# EAGLE board MicroRC-C (EAGLE 5.11), part 1 of 2
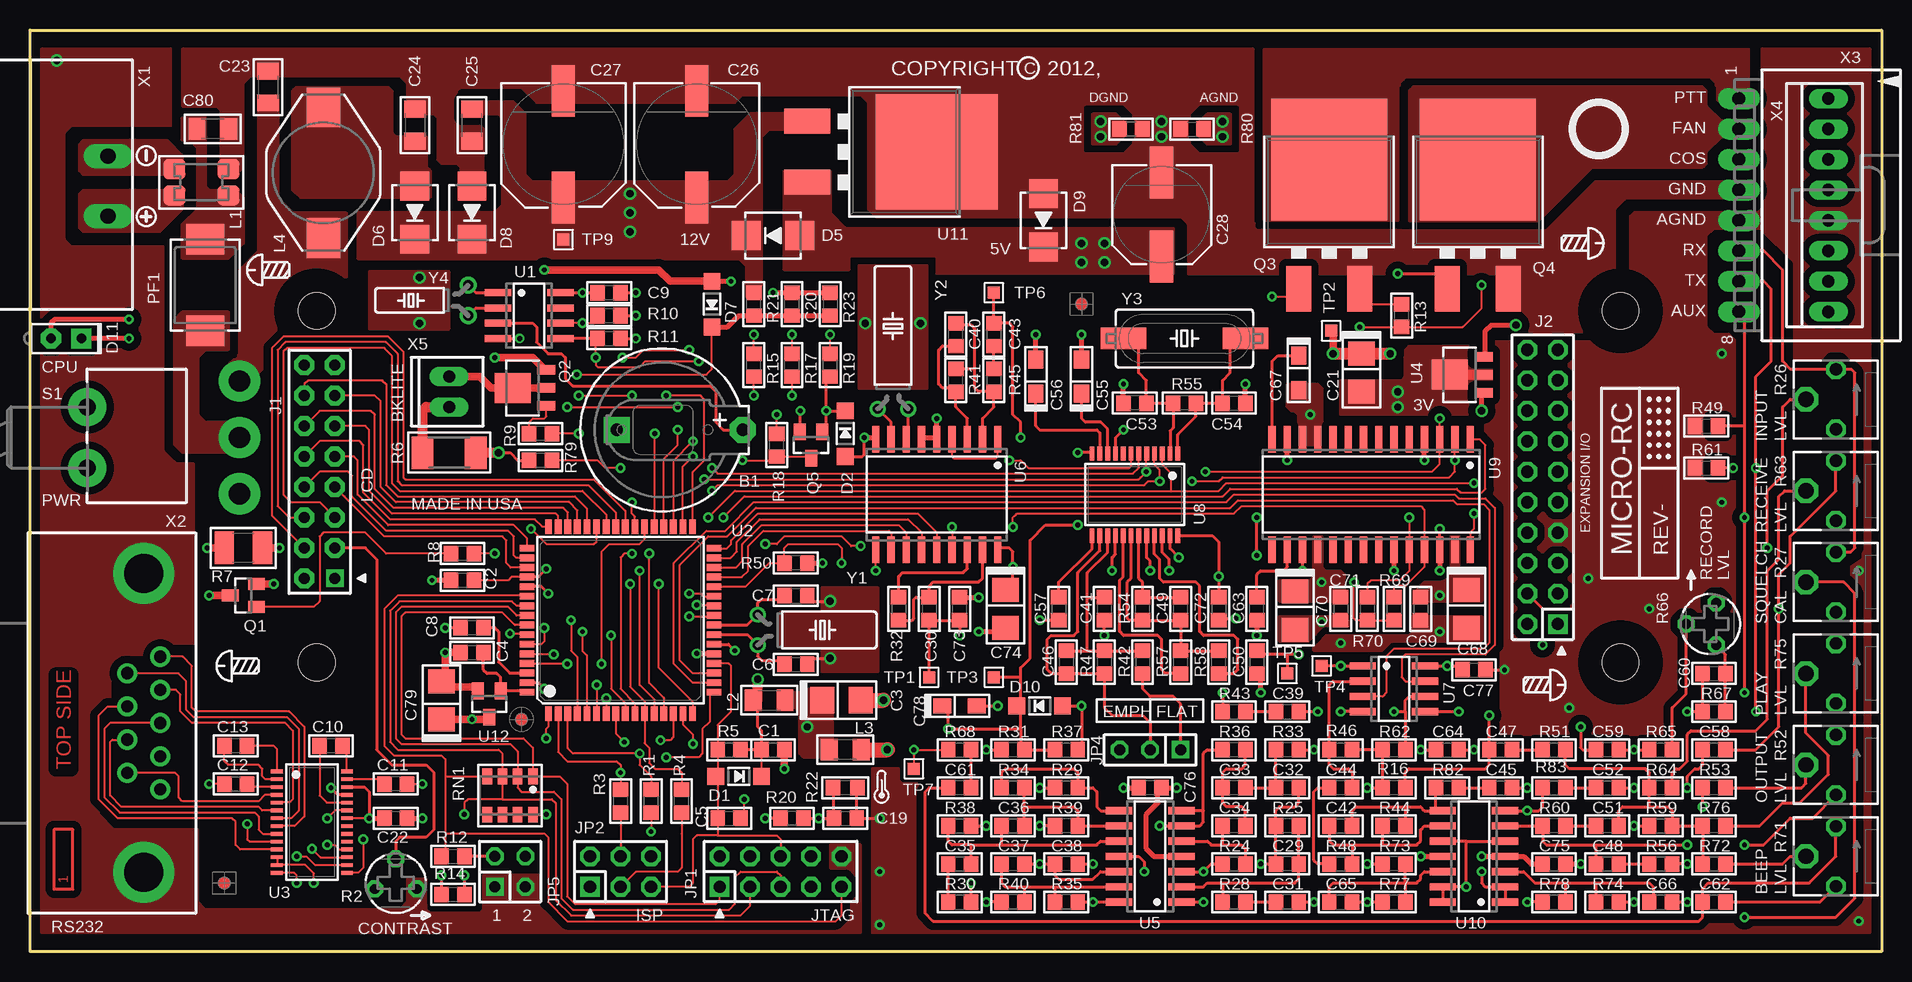
[diagram p3: board, top side]
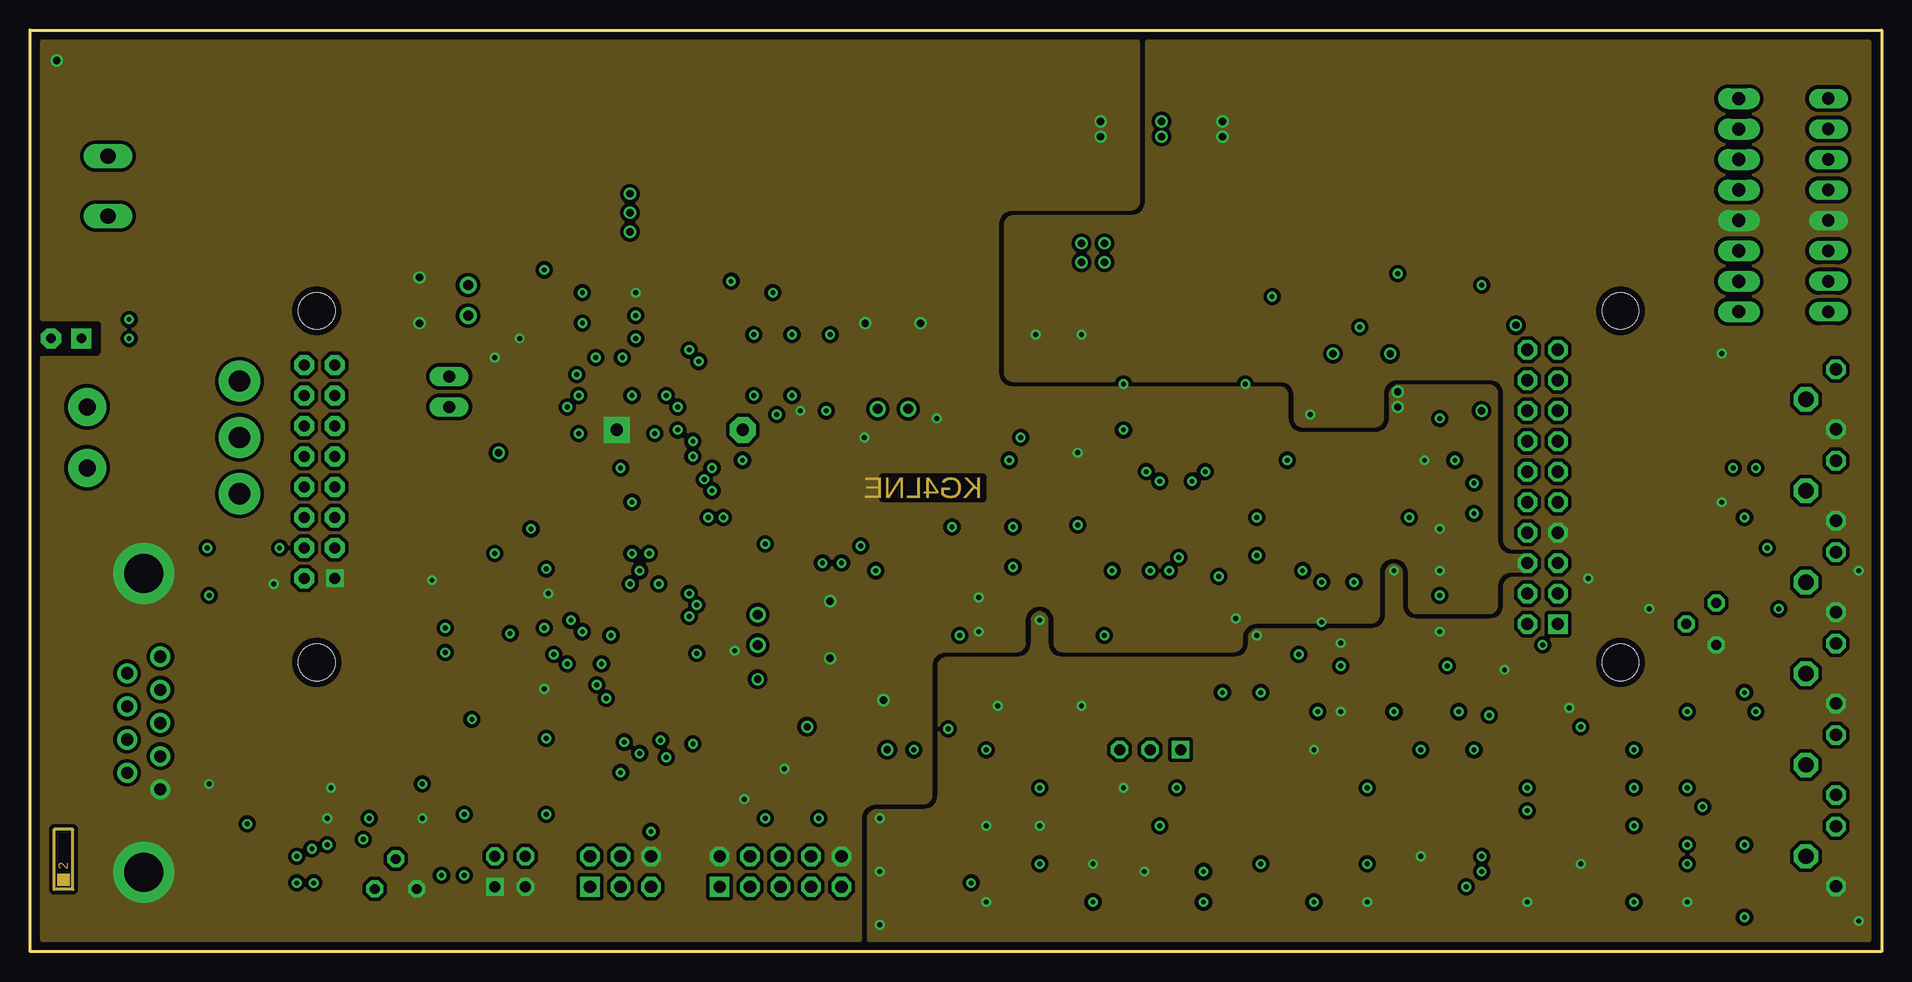
[diagram p4: board, inner layer GROUND]
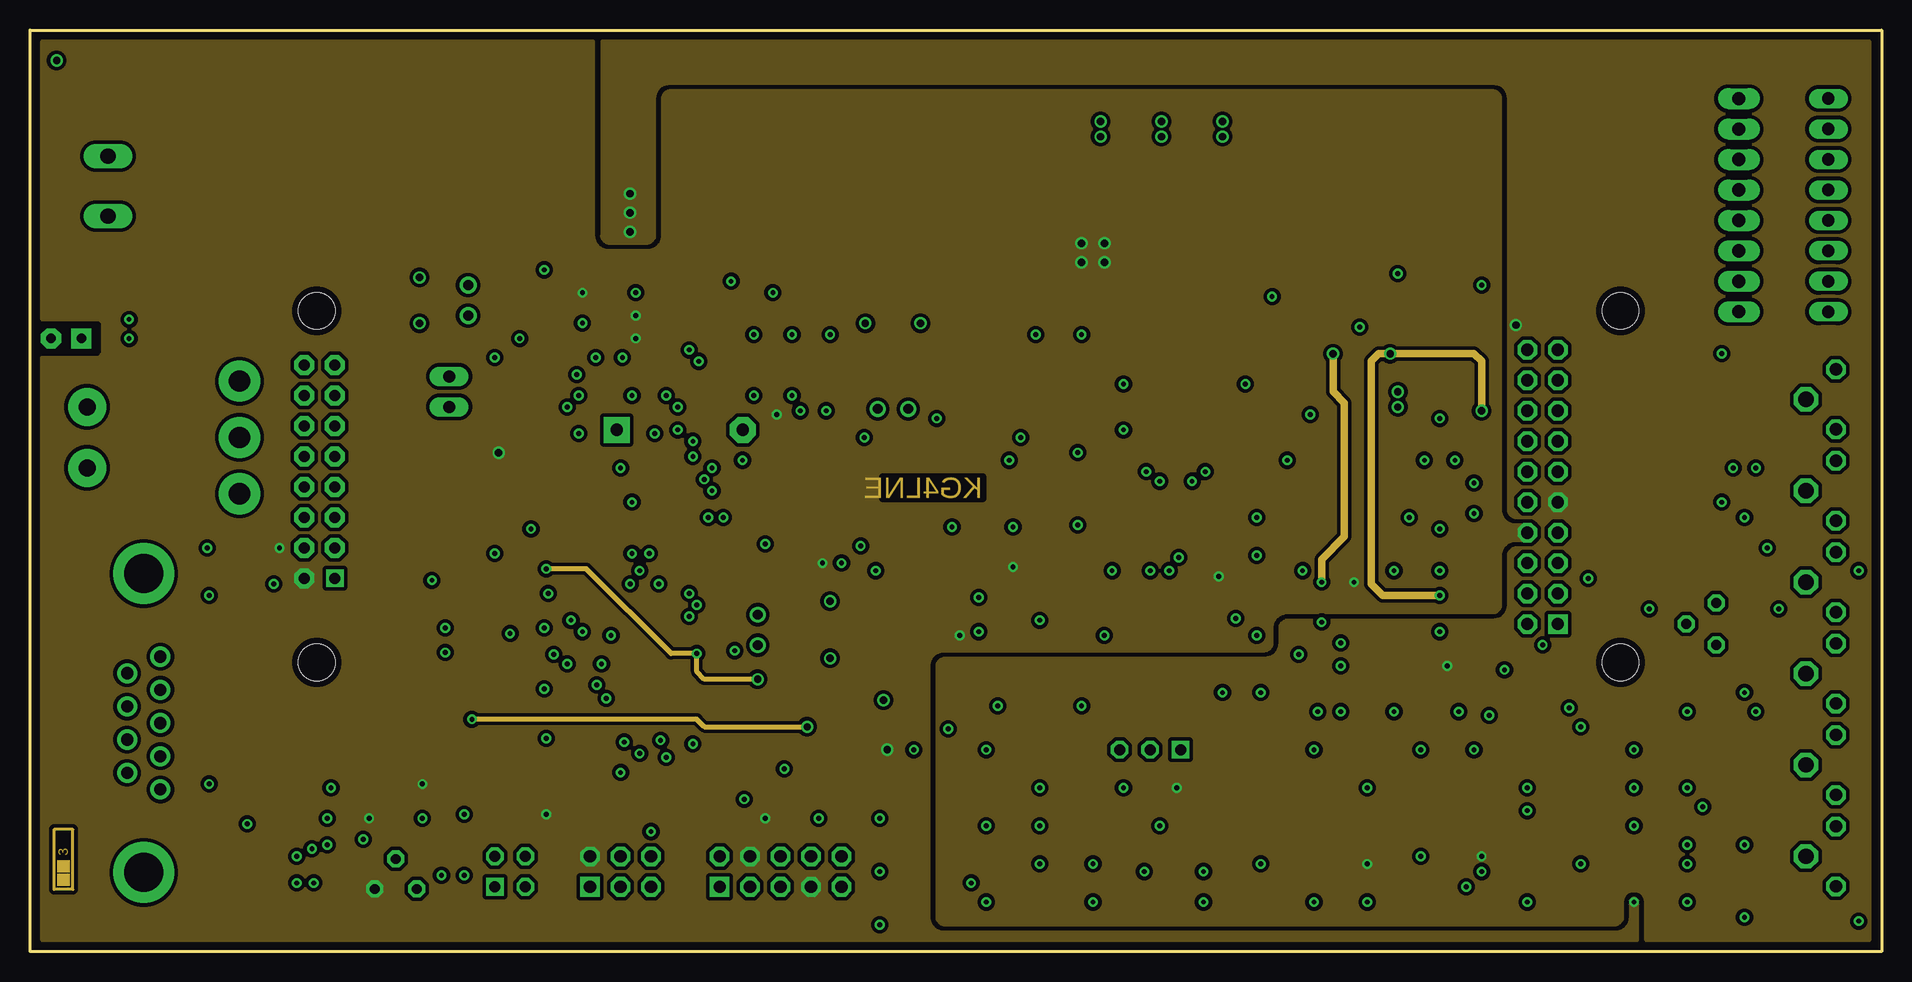
[diagram p5: board, inner layer SUPPLY]
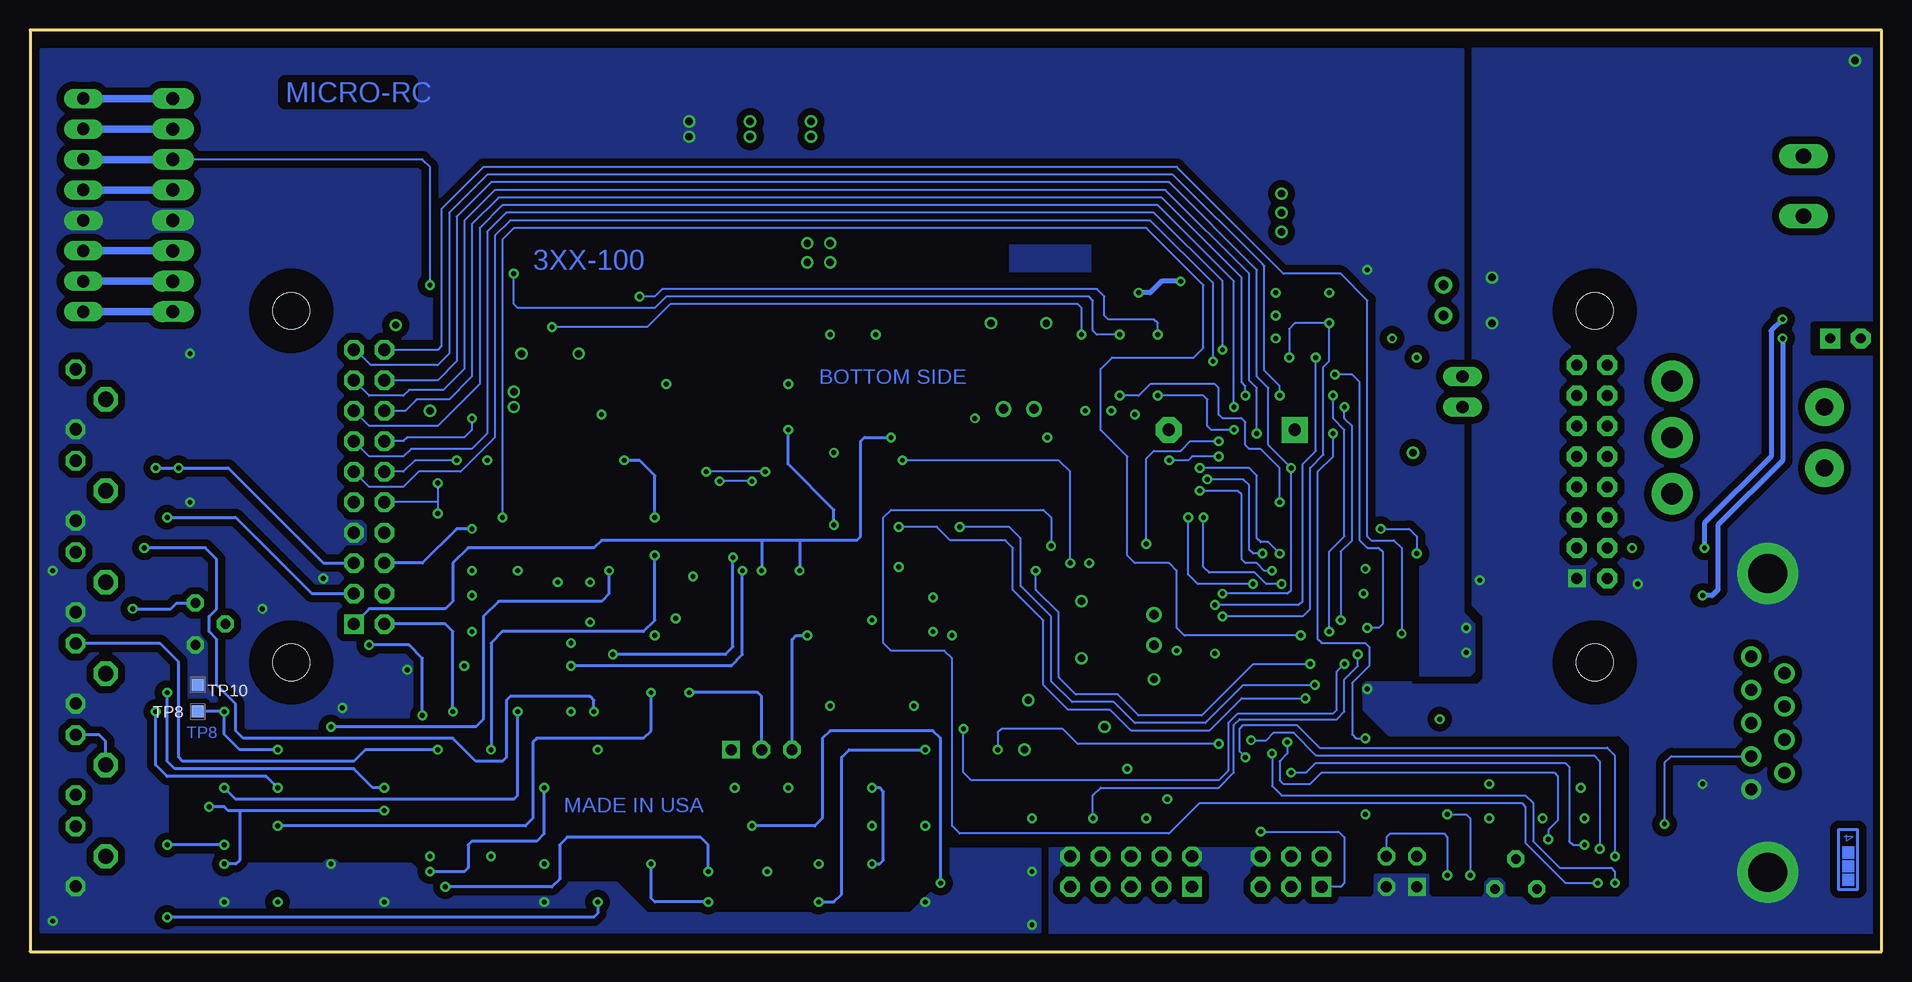
[diagram p6: board, bottom side, seen from below]

Size 154.31 x 76.83 mm. Coordinates in mm from the lower left corner, seen from the top.
Outline: 0,76.83 154.31,76.83 154.31,0 0,0 0,76.83
Copper layers (1*2+3*16): Top 0.035mm / dielectric 0.36mm / GROUND 0.035mm / dielectric 0.71mm / SUPPLY 0.035mm / dielectric 0.36mm / Bottom 0.035mm
Design rules "PRD_SN": minimum track width 2mil, minimum drill 16mil, track to track 8mil, track to pad 8mil, pad to pad 8mil, via to via 8mil, smd to smd 8mil, copper to edge 20mil, drill to drill 8mil, minimum pad ring 10mil, minimum via ring 8mil, stop-mask expansion 4mil, vias tented up to drill 32mil, thermal gap 24mil
Holes 0.41 mm at 198.11,50.4
Holes 0.61 mm at 198.11,45.32
Holes 0.81 mm at 198.11,40.24
Holes 0.91 mm at 198.11,35.16
Holes 1.02 mm at 198.11,30.08
Holes 1.09 mm at 198.11,25
Holes 1.27 mm at 198.11,19.92
Holes 1.42 mm at 198.11,14.84
Holes 1.78 mm at 198.11,9.76
Holes 3.05 mm at 198.11,4.68

## Footprints (pad centres in the part's own frame; a part is rotated, then mirrored left to right if it is on the bottom)
BR1225 = drill 1.016 pad 2.159 octagon: + 5.75,0 | drill 1.016 pad 2.159 square: - -4.75,0
C0805 = smd 1.2 x 1.3: 1 -0.953,0; 2 0.953,0
C3528/T = smd 2 x 2.2: + 1.587,0; - -1.587,0
C1206 = smd 1.4 x 1.8: 1 -1.329,0; 2 1.329,0
CSV-G = smd 4.318 x 1.93: + -4.445,0; - 4.445,0
CSV-E/F = smd 4.318 x 1.93: + -3.493,0; - 3.493,0
C3216/T = smd 1.5 x 1.27: + 1.429,0; - -1.429,0
SOD123 = smd 1.4 x 1.4: A 1.905,0; C -1.905,0
SMB = smd 2.4 x 2.4: A 2.223,0; C -2.223,0
LED535 = drill 0.813 pad 1.676 octagon: A -1.27,0 | drill 0.813 pad 1.676 square: K 1.27,0
DMC20261 = drill 0.914 pad 1.422 square: 1 2.54,-7.62 | drill 0.914 pad 1.676 octagon: 2 0,-7.62; 3 2.54,-5.08; 4 0,-5.08; 5 2.54,-2.54; 6 0,-2.54; 7 2.54,0; 8 0,0; 9 2.54,2.54; 10 0,2.54; 11 2.54,5.08; 12 0,5.08; 13 2.54,7.62; 14 0,7.62; 15 2.54,10.16; 16 0,10.16 | hole 3.048: 1.039,14.683; 1.039,-14.635; 109.674,-14.635; 109.674,14.682
MA10-2 = drill 1.016 square: 1 -11.43,-1.27 | drill 1.016 octagon: 2 -11.43,1.27; 3 -8.89,-1.27; 4 -8.89,1.27; 5 -6.35,-1.27; 6 -6.35,1.27; 7 -3.81,-1.27; 8 -3.81,1.27; 9 -1.27,-1.27; 10 -1.27,1.27; 11 1.27,-1.27; 12 1.27,1.27; 13 3.81,-1.27; 14 3.81,1.27; 15 6.35,-1.27; 16 6.35,1.27; 17 8.89,-1.27; 18 8.89,1.27; 19 11.43,-1.27; 20 11.43,1.27
AVR-JTAG-10 = drill 1.016 square: 1 -5.08,-1.27 | drill 1.016 octagon: 2 -5.08,1.27; 3 -2.54,-1.27; 4 -2.54,1.27; 5 0,-1.27; 6 0,1.27; 7 2.54,-1.27; 8 2.54,1.27; 9 5.08,-1.27; 10 5.08,1.27
AVR-ISP-6 = drill 1.016 square: 1 -2.54,-1.27 | drill 1.016 octagon: 2 -2.54,1.27; 3 0,-1.27; 4 0,1.27; 5 2.54,-1.27; 6 2.54,1.27
JP2 = drill 0.914 square: 1 -2.54,0 | drill 0.914 octagon: 2 0,0; 3 2.54,0
JP2Q = drill 0.914 square: 1 -1.27,-1.27 | drill 0.914 octagon: 2 -1.27,1.27; 3 1.27,-1.27; 4 1.27,1.27
CM1812 = smd 1.841 x 1.689: 1 -2.25,1.1; 2 -2.25,-1.1; 3 2.25,-1.1; 4 2.25,1.1
L1206 = smd 1.4 x 1.8: 1 -1.329,0; 2 1.329,0
PM-13 = smd 3.302 x 2.794: 1 -5.447,0; 2 5.447,0
SMD-7555 = smd 2.54 x 3.175: 1 -3.81,0; 2 3.81,0
SOT23@1 = smd 1 x 1.4: 1 -0.95,-1.1; 2 0.95,-1.1; 3 0,1.1
SOT89 = smd 0.8 x 1.5: 1 -1.5,-1.75; 2 0,-1.75; 3 1.5,-1.75 | smd 2.5 x 3: 4 0,1.05
D2PAK = smd 2.08 x 3.81: 1 -2.54,-8.255; 3 2.54,-8.255 | smd 9.652 x 10.16: 2 0,2.54
R0805 = smd 1.2 x 1.3: 1 -0.953,0; 2 0.953,0
EVM-L4G = drill 0.813 pad 1.422 octagon: 1 -1.75,-0.5; 2 0,2; 3 1.75,-0.5
R2010 = smd 1.8 x 2.7: 1 -2.223,0; 2 2.223,0
R1210 = smd 1.6 x 2.7: 1 -1.587,0; 2 1.587,0
R0805' = smd 1.2 x 1.3: 1 -1.016,0; 2 1.016,0
EVME-SIDE = drill 1.016 octagon: 1 -2.5,0; 3 2.5,0 | drill 1.27 octagon: 2 0,2.5
744-8 = smd 0.8 x 1.3: 1 -1.905,-1.587; 2 -0.635,-1.587; 3 0.635,-1.587; 4 1.905,-1.587; 5 1.905,1.587; 6 0.635,1.587; 7 -0.635,1.587; 8 -1.905,1.587
CK-A = drill 1.778 pad 3.429 round: 1 8.89,-4.699; 2 8.89,0; 3 8.89,4.699 | drill 1.422 pad 3.175 round: B1 -3.81,-2.54; B2 -3.81,2.54
TP10SQ = smd 1 x 1: TP 0,0
SMD-10SN = smd 1 x 1: TP 0,0
SO08 = smd 0.6 x 2.2: 1 -1.905,-2.6; 2 -0.635,-2.6; 3 0.635,-2.6; 4 1.905,-2.6; 5 1.905,2.6; 6 0.635,2.6; 7 -0.635,2.6; 8 -1.905,2.6
TQFP64-AEB = smd 1.194 x 0.559: 1 -7.8,6; 2 -7.8,5.2; 3 -7.8,4.4; 4 -7.8,3.6; 5 -7.8,2.8; 6 -7.8,2; 7 -7.8,1.2; 8 -7.8,0.4; 9 -7.8,-0.4; 10 -7.8,-1.2; 11 -7.8,-2; 12 -7.8,-2.8; 13 -7.8,-3.6; 14 -7.8,-4.4; 15 -7.8,-5.2; 16 -7.8,-6; 33 7.8,-6; 34 7.8,-5.2; 35 7.8,-4.4; 36 7.8,-3.6; 37 7.8,-2.8; 38 7.8,-2; 39 7.8,-1.2; 40 7.8,-0.4; 41 7.8,0.4; 42 7.8,1.2; 43 7.8,2; 44 7.8,2.8; 45 7.8,3.6; 46 7.8,4.4; 47 7.8,5.2; 48 7.8,6 | smd 0.559 x 1.194: 17 -6,-7.8; 18 -5.2,-7.8; 19 -4.4,-7.8; 20 -3.6,-7.8; 21 -2.8,-7.8; 22 -2,-7.8; 23 -1.2,-7.8; 24 -0.4,-7.8; 25 0.4,-7.8; 26 1.2,-7.8; 27 2,-7.8; 28 2.8,-7.8; 29 3.6,-7.8; 30 4.4,-7.8; 31 5.2,-7.8; 32 6,-7.8; 49 6,7.8; 50 5.2,7.8; 51 4.4,7.8; 52 3.6,7.8; 53 2.8,7.8; 54 2,7.8; 55 1.2,7.8; 56 0.4,7.8; 57 -0.4,7.8; 58 -1.2,7.8; 59 -2,7.8; 60 -2.8,7.8; 61 -3.6,7.8; 62 -4.4,7.8; 63 -5.2,7.8; 64 -6,7.8
TSSOP28 = smd 0.305 x 0.991: 1 -4.225,-2.918; 2 -3.575,-2.918; 3 -2.925,-2.918; 4 -2.275,-2.918; 5 -1.625,-2.918; 6 -0.975,-2.918; 7 -0.325,-2.918; 8 0.325,-2.918; 9 0.975,-2.918; 10 1.625,-2.918; 11 2.275,-2.918; 12 2.925,-2.918; 13 3.575,-2.918; 14 4.225,-2.918; 15 4.225,2.918; 16 3.575,2.918; 17 2.925,2.918; 18 2.275,2.918; 19 1.625,2.918; 20 0.975,2.918; 21 0.325,2.918; 22 -0.325,2.918; 23 -0.975,2.918; 24 -1.625,2.918; 25 -2.275,2.918; 26 -2.925,2.918; 27 -3.575,2.918; 28 -4.225,2.918
SOT89-4 = smd 0.8 x 1.5: 1 -1.5,-1.75; 2 0,-1.75; 3 1.5,-1.75 | smd 2.5 x 3: 4 0,1.05
SO14 = smd 0.6 x 2.2: 1 -3.81,-2.6; 2 -2.54,-2.6; 3 -1.27,-2.6; 4 0,-2.6; 5 1.27,-2.6; 6 2.54,-2.6; 7 3.81,-2.6; 8 3.81,2.6; 9 2.54,2.6; 10 1.27,2.6; 11 0,2.6; 12 -1.27,2.6; 13 -2.54,2.6; 14 -3.81,2.6
SO18W = smd 0.6 x 2.2: 1 -5.08,-4.6; 2 -3.81,-4.6; 3 -2.54,-4.6; 4 -1.27,-4.6; 5 0,-4.6; 6 1.27,-4.6; 7 2.54,-4.6; 8 3.81,-4.6; 9 5.08,-4.6; 10 5.08,4.6; 11 3.81,4.6; 12 2.54,4.6; 13 1.27,4.6; 14 0,4.6; 15 -1.27,4.6; 16 -2.54,4.6; 17 -3.81,4.6; 18 -5.08,4.6
SSOP24 = smd 0.4 x 1.2: 1 -3.575,-3.42; 2 -2.925,-3.42; 3 -2.275,-3.42; 4 -1.625,-3.42; 5 -0.975,-3.42; 6 -0.325,-3.42; 7 0.325,-3.42; 8 0.975,-3.42; 9 1.625,-3.42; 10 2.275,-3.42; 11 2.925,-3.42; 12 3.575,-3.42; 13 3.575,3.42; 14 2.925,3.42; 15 2.275,3.42; 16 1.625,3.42; 17 0.975,3.42; 18 0.325,3.42; 19 -0.325,3.42; 20 -0.975,3.42; 21 -1.625,3.42; 22 -2.275,3.42; 23 -2.925,3.42; 24 -3.575,3.42
SO28W = smd 0.6 x 2.2: 1 -8.255,-4.6; 2 -6.985,-4.6; 3 -5.715,-4.6; 4 -4.445,-4.6; 5 -3.175,-4.6; 6 -1.905,-4.6; 7 -0.635,-4.6; 8 0.635,-4.6; 9 1.905,-4.6; 10 3.175,-4.6; 11 4.445,-4.6; 12 5.715,-4.6; 13 6.985,-4.6; 14 8.255,-4.6; 15 8.255,4.6; 16 6.985,4.6; 17 5.715,4.6; 18 4.445,4.6; 19 3.175,4.6; 20 1.905,4.6; 21 0.635,4.6; 22 -0.635,4.6; 23 -1.905,4.6; 24 -3.175,4.6; 25 -4.445,4.6; 26 -5.715,4.6; 27 -6.985,4.6; 28 -8.255,4.6
SOT23 = smd 1 x 1.4: 1 -0.95,-1.1; 2 0.95,-1.1; 3 0,1.1
951-2 = drill 1.27 pad 1.93 long: 1 -2.5,0; 2 2.5,0
NC182M9 = drill 1.016 pad 1.676 round: 1 -5.537,2.769; 2 -2.769,2.769; 3 0,2.769; 4 2.769,2.769; 5 5.537,2.769; 6 -4.153,0; 7 -1.384,0; 8 1.384,0; 9 4.153,0 | drill 3.251 pad 5.08 round: G1 12.459,1.384; G2 -12.459,1.384
70553-08 = drill 1.092 long: 1 -8.89,-7.62; 2 -6.35,-7.62; 3 -3.81,-7.62; 4 -1.27,-7.62; 5 1.27,-7.62; 6 3.81,-7.62; 7 6.35,-7.62; 8 8.89,-7.62
MTA08-100 = drill 1.016 long: 1 8.89,0; 2 6.35,0; 3 3.81,0; 4 1.27,0; 5 -1.27,0; 6 -3.81,0; 7 -6.35,0; 8 -8.89,0
MTA-100-2V = drill 1.016 long: 1 -1.27,0; 2 1.27,0
TC38H = drill 0.813 round: 1 -1.27,0; 2 1.27,0
TC310H = drill 0.813 round: 1 -1.27,0; 2 1.27,0
SM49 = smd 3.81 x 1.778: 1 -5.08,0; 2 5.08,0
TC26H = drill 0.813 pad 1.422 round: 1 -1.27,0; 2 1.27,0

## Placement (x,y rotation side)
B1  BR1225A/HB  [BR1225]  53.66,43.5 0 top
C1  1uF  [C0805]  61.91,16.83 0 top
C2  0.1uF  [C0805]  36.04,30.96 180 top
C3  10uF  [C3528/T]  67.63,20.95 180 top
C4  10uF  [C0805]  36.83,24.92 0 top
C5  0.01uF  [C0805]  58.26,11.11 0 top
C6  22pF  [C0805]  63.82,23.95 0 top
C7  22pF  [C0805]  63.82,29.67 0 top
C8  0.1uF  [C0805]  36.83,26.99 180 top
C9  0.1uF  [C0805]  48.26,54.93 0 top
C10  0.1uF  [C0805]  25.08,17.14 180 top
C11  0.47uF  [C0805]  30.48,13.97 180 top
C12  0.47uF  [C0805]  17.14,13.97 0 top
C13  0.47uF  [C0805]  17.14,17.14 180 top
C19  0.1uF  [C0805]  67.94,11.11 0 top
C20  0.1uF  [C0805]  63.5,53.97 90 top
C21  10uF  [C3528/T]  110.97,48.26 90 top
C22  1uF  [C0805]  30.48,11.11 0 top
C23  0.1uF  [C1206]  19.84,72.07 90 top
C24  0.1uF  [C1206]  32.07,68.9 90 top
C25  0.1uF  [C1206]  36.83,68.9 270 top
C26  470uF  [CSV-G]  55.56,67.31 90 top
C27  470uF  [CSV-G]  44.45,67.31 90 top
C28  100uF  [CSV-E/F]  94.3,61.44 90 top
C29  100pF  [C0805]  104.78,7.3 180 top
C30  0.1uF  [C0805]  74.93,28.57 270 top
C31  0.1uF  [C0805]  104.78,4.13 180 top
C32  1500pF  [C0805]  104.78,13.65 180 top
C33  1500pF  [C0805]  100.33,13.65 180 top
C34  1500pF  [C0805]  100.33,10.48 180 top
C35  0.047uF  [C0805]  77.47,7.3 0 top
C36  470pF  [C0805]  81.92,10.48 0 top
C37  470pF  [C0805]  81.92,7.3 180 top
C38  0.047uF  [C0805]  86.36,7.3 180 top
C39  1uF  [C0805]  104.78,20 0 top
C40  0.001uF  [C0805]  77.15,51.43 90 top
C41  0.0068uF  [C0805]  89.53,28.57 270 top
C42  1500pF  [C0805]  109.22,10.48 0 top
C43  0.1uF  [C0805]  80.33,51.43 270 top
C44  1uF  [C0805]  109.22,13.65 180 top
C45  1uF  [C0805]  122.56,13.65 0 top
C46  100pF  [C0805]  86.36,24.13 270 top
C47  1uF  [C0805]  122.56,16.83 0 top
C48  560pF  [C0805]  131.44,7.3 0 top
C49  100pF  [C0805]  95.89,28.57 90 top
C50  1uF  [C0805]  102.23,24.13 270 top
C51  10uF  [C0805]  131.44,10.48 180 top
C52  1uF  [C0805]  131.44,13.65 0 top
C53  33pF  [C0805]  92.08,45.72 180 top
C54  33pF  [C0805]  100.33,45.72 0 top
C55  0.1uF  [C3216/T]  87.63,47.94 270 top
C56  2.2uF  [C3216/T]  83.82,47.94 270 top
C57  0.1uF  [C0805]  85.72,28.57 270 top
C58  1uF  [C0805]  140.34,16.83 0 top
C59  1uF  [C0805]  131.44,16.83 180 top
C60  4700pF  [C0805]  140.34,23.18 0 top
C61  1uF  [C0805]  77.47,13.65 180 top
C62  0.001uF  [C0805]  140.34,4.13 0 top
C63  0.1uF  [C0805]  102.23,28.57 90 top
C64  1uF  [C0805]  118.11,16.83 0 top
C65  1uF  [C0805]  109.22,4.13 0 top
C66  1uF  [C0805]  135.89,4.13 0 top
C67  1uF  [C3216/T]  105.73,48.26 90 top
C68  22uF  [C3528/T]  119.7,28.57 90 top
C69  0.1uF  [C0805]  115.89,28.57 270 top
C70  22uF  [C3528/T]  105.41,28.42 90 top
C71  0.1uF  [C0805]  109.22,28.57 270 top
C72  0.1uF  [C0805]  99.06,28.57 270 top
C73  0.1uF  [C0805]  77.47,28.57 90 top
C74  22uF  [C3528/T]  81.28,28.57 90 top
C75  0.1uF  [C0805]  127,7.3 0 top
C76  0.1uF  [C0805]  93.34,13.65 180 top
C77  0.1uF  [C0805]  120.33,23.49 0 top
C78  0.1uF  [C3216/T]  77.47,20.48 180 top
C79  10uF  [C3528/T]  34.29,20.96 270 top
C80  0.01uF  [C1206]  15.24,68.58 0 top
D1  BAV16W-7-F  [SOD123]  59.05,14.6 180 top
D2  5.1V  [SOD123]  67.94,43.18 270 top
D5  S1GB-13  [SMB]  61.91,59.69 0 top
D6  S1GB-13  [SMB]  32.07,61.59 90 top
D7  BZT52C5V1-7-F  [SOD123]  56.83,53.97 90 top
D8  18V  [SMB]  36.83,61.59 90 top
D9  S1GB-13  [SMB]  84.45,60.96 90 top
D10  BZT52C5V1-7-F  [SOD123]  84.14,20.48 0 top
D11  RED  [LED535]  3.02,51.12 0 top
FIDUCIAL1  FIDUCIAL-G10S  [G10S]  16.19,5.71 0 top
FIDUCIAL2  FIDUCIAL-G10S  [G10S]  87.63,53.97 0 top
FIDUCIAL3  FIDUCIAL-G10  [G10]  40.96,19.37 0 top
J1  DMC20261  [DMC20261]  22.86,38.73 0 top
J2  [MA10-2]  126.05,38.73 90 top
JP1  AVR-JTAG-10  [AVR-JTAG-10]  62.55,6.67 0 top
JP2  AVR-ISP-6  [AVR-ISP-6]  49.21,6.67 0 top
JP4  [JP2]  93.34,16.83 180 top
JP5  [JP2Q]  40.01,6.67 0 top
L1  CM1812  [CM1812]  14.29,64.13 0 top
L2  0.1uH  [L1206]  61.59,20.95 180 top
L3  FB-M1331  [L1206]  67.94,16.83 0 top
L4  10uH  [PM-13]  24.45,64.93 90 top
PF1  MF-SM030-2  [SMD-7555]  14.61,55.56 270 top
Q1  MMBTA05LT1G  [SOT23@1]  17.78,29.69 90 top
Q2  ZXMN6A07Z  [SOT89]  41.27,46.99 90 top
Q3  IRF614SPBF  [D2PAK]  108.27,63.5 0 top
Q4  IRF614SPBF  [D2PAK]  120.65,63.5 0 top
Q5  MMBTA05LT1G  [SOT23@1]  65.09,42.23 180 top
R1  47.5R  [R0805]  51.75,12.54 90 top
R2  10K  [EVM-L4G]  30.48,5.71 0 top
R3  47.5R  [R0805]  49.21,12.54 90 top
R4  47.5R  [R0805]  54.29,12.54 90 top
R5  10K  [R0805]  58.26,16.83 0 top
R6  48.7R  [R2010]  34.92,41.59 180 top
R7  464R  [R1210]  17.78,33.65 180 top
R8  4.75K  [R0805]  36.04,33.18 180 top
R9  4.75K  [R0805]  42.55,43.18 180 top
R10  10K  [R0805]  48.26,53.02 0 top
R11  10K  [R0805]  48.26,51.12 0 top
R12  47.5R  [R0805]  35.24,7.94 0 top
R13  100K  [R0805]  114.3,53.02 90 top
R14  47.5R  [R0805]  35.24,4.76 0 top
R15  4.75K  [R0805]  60.33,48.89 90 top
R16  1M  [R0805]  113.67,13.65 180 top
R17  4.75K  [R0805]  63.5,48.89 90 top
R18  10K  [R0805]  62.23,42.23 90 top
R19  4.75K  [R0805]  66.67,48.89 90 top
R20  100K  [R0805]  63.5,11.11 180 top
R21  62K  [R0805]  60.33,53.97 90 top
R22  NCP21WF104J03RA  [R0805']  67.94,13.65 180 top
R23  22K  [R0805]  66.67,53.97 270 top
R24  91.0K  [R0805]  100.33,7.3 0 top
R25  10K  [R0805]  104.78,10.48 180 top
R26  10K  [EVME-SIDE]  150.5,46.04 90 top
R27  10K  [EVME-SIDE]  150.5,30.8 90 top
R28  10K  [R0805]  100.33,4.13 180 top
R29  332K  [R0805]  86.36,13.65 0 top
R30  4.75K  [R0805]  77.47,4.13 0 top
R31  22K  [R0805]  81.92,16.83 180 top
R32  301K  [R0805]  72.39,28.57 270 top
R33  4.75K  [R0805]  104.78,16.83 180 top
R34  100K  [R0805]  81.92,13.65 0 top
R35  150K  [R0805]  86.36,4.13 180 top
R36  5.62K  [R0805]  100.33,16.83 180 top
R37  100K  [R0805]  86.36,16.83 0 top
R38  8.25K  [R0805]  77.47,10.48 0 top
R39  10K  [R0805]  86.36,10.48 180 top
R40  10K  [R0805]  81.92,4.13 180 top
R41  100K  [R0805]  77.15,47.62 90 top
R42  11.3K  [R0805]  92.71,24.13 270 top
R43  10K  [R0805]  100.33,20 0 top
R44  22K  [R0805]  113.67,10.48 0 top
R45  100K  [R0805]  80.33,47.62 270 top
R46  1M  [R0805]  109.22,16.83 0 top
R47  93.1K  [R0805]  89.53,24.13 270 top
R48  22K  [R0805]  109.22,7.3 0 top
R49  100K  [R0805]  139.7,43.81 0 top
R50  10K  [R0805]  63.82,32.38 180 top
R51  22K  [R0805]  127,16.83 0 top
R52  200K  [EVME-SIDE]  150.5,15.56 90 top
R53  33.2K  [R0805]  140.34,13.65 180 top
R54  10K  [R0805]  92.71,28.57 90 top
R55  1M  [R0805]  96.2,45.72 180 top
R56  10K  [R0805]  135.89,7.3 0 top
R57  10K  [R0805]  95.89,24.13 90 top
R58  10K  [R0805]  99.06,24.13 90 top
R59  22K  [R0805]  135.89,10.48 0 top
R60  33.2K  [R0805]  127,10.48 180 top
R61  100K  [R0805]  139.7,40.32 0 top
R62  1M  [R0805]  113.67,16.83 180 top
R63  10K  [EVME-SIDE]  150.5,38.42 90 top
R64  22K  [R0805]  135.89,13.65 180 top
R65  10K  [R0805]  135.89,16.83 0 top
R66  10K  [EVM-L4G]  140.02,27.3 90 top
R67  10K  [R0805]  140.34,20 0 top
R68  100K  [R0805]  77.47,16.83 0 top
R69  10K  [R0805]  113.67,28.57 270 top
R70  10K  [R0805]  111.44,28.57 270 top
R71  10K  [EVME-SIDE]  150.5,7.94 90 top
R72  22K  [R0805]  140.34,7.3 0 top
R73  100K  [R0805]  113.67,7.3 180 top
R74  100K  [R0805]  131.44,4.13 0 top
R75  10K  [EVME-SIDE]  150.5,23.18 90 top
R76  22K  [R0805]  140.34,10.48 180 top
R77  100K  [R0805]  113.67,4.13 0 top
R78  100K  [R0805]  127,4.13 0 top
R79  10K  [R0805]  42.55,40.96 180 top
R80  0R  [R0805]  96.84,68.58 0 top
R81  0R  [R0805]  91.76,68.58 180 top
R82  1.00K  [R0805]  118.11,13.65 0 top
R83  1.00K  [R0805]  127,13.65 0 top
RN1  10K  [744-8]  40.01,13.02 180 top
S1  CK-A  [CK-A]  8.57,42.86 0 top
TP1  TPTP10SQ  [TP10SQ]  74.93,22.86 270 top
TP2  TPTP10SQ  [TP10SQ]  108.43,51.75 180 top
TP3  TPTP10SQ  [TP10SQ]  80.33,22.86 270 top
TP4  TPTP10SQ  [TP10SQ]  107.63,23.81 90 top
TP5  TPTP10SQ  [TP10SQ]  104.78,23.18 90 top
TP6  TPTP10SQ  [TP10SQ]  80.33,54.93 90 top
TP7  TPTP10SQ  [TP10SQ]  73.66,15.24 270 top
TP8  TPS-SMD-10SN  [SMD-10SN]  140.34,20 180 bottom
TP9  TPTP10SQ  [TP10SQ]  44.45,59.37 0 top
TP10  TPS-SMD-10SN  [SMD-10SN]  140.34,22.22 180 bottom
U1  DS1307Z  [SO08]  41.59,53.02 270 top
U2  MEGA1281/2561  [TQFP64-AEB]  49.21,27.62 90 top
U3  MAX3243IPWR  [TSSOP28]  23.5,10.79 270 top
U4  L78L33ACUTR  [SOT89-4]  119.38,48.1 90 top
U5  LM324D  [SO14]  93.34,7.94 90 top
U6  CM8870CS  [SO18W]  75.56,38.1 180 top
U7  MAX323CSA  [SO08]  113.67,21.91 270 top
U8  MX828DS  [SSOP24]  92.08,38.1 180 top
U9  ISD4002S  [SO28W]  111.76,38.1 180 top
U10  TL084D  [SO14]  120.33,7.94 90 top
U11  L7805ACD2T  [D2PAK]  73.03,66.67 270 top
U12  AD158X  [SOT23]  38.26,20.64 180 top
U$6  [ICON_ATTR_COPYRIGHT]  71.75,73.02 0 top
U$7  [LAYER_CHECK-4]  3.17,5.71 90 top
U$60  [FIELD_ATTR_DATECODE5_RESTRICT]  72.07,57.15 0 bottom
U$74  [ICON_SIDE_BOTTOM]  88.58,47.31 0 top
U$75  [ICON_SIDE_TOP]  3.43,15.18 90 top
U$100  [ICON_ATTR_REV-M]  130.81,68.58 0 top
U$102  [FAB_8X14]  -39.37,-84.45 0 top  (outside the outline)
U$105  [FAB_DOCFIELD]  168.91,-84.45 0 top  (outside the outline)
U$112  [ICON_TEMP]  70.96,13.02 0 top
U$123  [ICON_MINUS]  9.68,66.36 90 top
U$124  3.0250  [FAB_ARROW_LINE025]  -1.27,0 180 top
U$125  [ICON_PLUS]  9.68,61.28 0 top
U$128  0,0  [FAB_ARROW_LINE025]  0,78.1 90 top
U$132  2.7125  [FAB_CONST_LINE050]  154.31,7.94 0 top
U$133  [ICON_MSCREW-S]  129.86,59.05 270 top
U$136  0,0  [FAB_ARROW_LINE025]  -1.27,76.83 180 top
U$138  6.0750  [FAB_ARROW_LINE025]  154.31,78.1 90 top
U$139  0.5750  [FAB_CONST_LINE050]  154.31,62.23 0 top
U$140  1.2125  [FAB_CONST_LINE050]  154.31,46.04 0 top
U$141  1.5125  [FAB_CONST_LINE050]  154.31,38.42 0 top
U$142  1.8125  [FAB_CONST_LINE050]  154.31,30.8 0 top
U$143  2.1125  [FAB_CONST_LINE050]  154.31,23.18 0 top
U$144  2.4125  [FAB_CONST_LINE050]  154.31,15.56 0 top
U$145  1.3375  [FAB_CONST_LINE050]  0,42.86 180 top
U$146  2.2750  [FAB_CONST_LINE050]  0,19.05 180 top
U$230  [ICON_PIN1_B]  127.64,25.4 270 top
U$235  [ICON_PIN1_B]  27.3,31.11 0 top
U$239  [ICON_MSCREW-S]  126.68,22.22 270 top
U$240  [ICON_ARROW-T]  33.34,3.02 270 top
U$241  [ICON_ARROW-T]  138.43,31.75 0 top
U$280  [ICON_PIN1_B]  46.67,3.49 270 top
U$281  [ICON_PIN1_B]  57.47,3.49 270 top
U$282  [ICON_MSCREW-S]  16.83,23.81 90 top
U$283  [ICON_MSCREW-S]  19.37,56.83 90 top
X1  EDSTLZ951/2  [951-2]  6.51,63.82 270 top
X2  182-009-112-531  [NC182M9]  8.1,19.05 270 top
X3  70553-0007  [70553-08]  150.02,62.23 270 top
X4  640454-8  [MTA08-100]  149.86,62.23 90 top
X5  640454-2  [MTA-100-2V]  34.92,46.67 90 top
Y1  16.000 MHz  [TC38H]  60.64,26.81 270 top
Y2  3.579 MHZ  [TC310H]  71.91,45.24 0 top
Y3  4.032MHZ  [SM49]  96.2,51.12 0 top
Y4  32.678 kHz  [TC26H]  36.51,54.29 90 top